# Altium project latch_shutdown_proj.PrjPCB
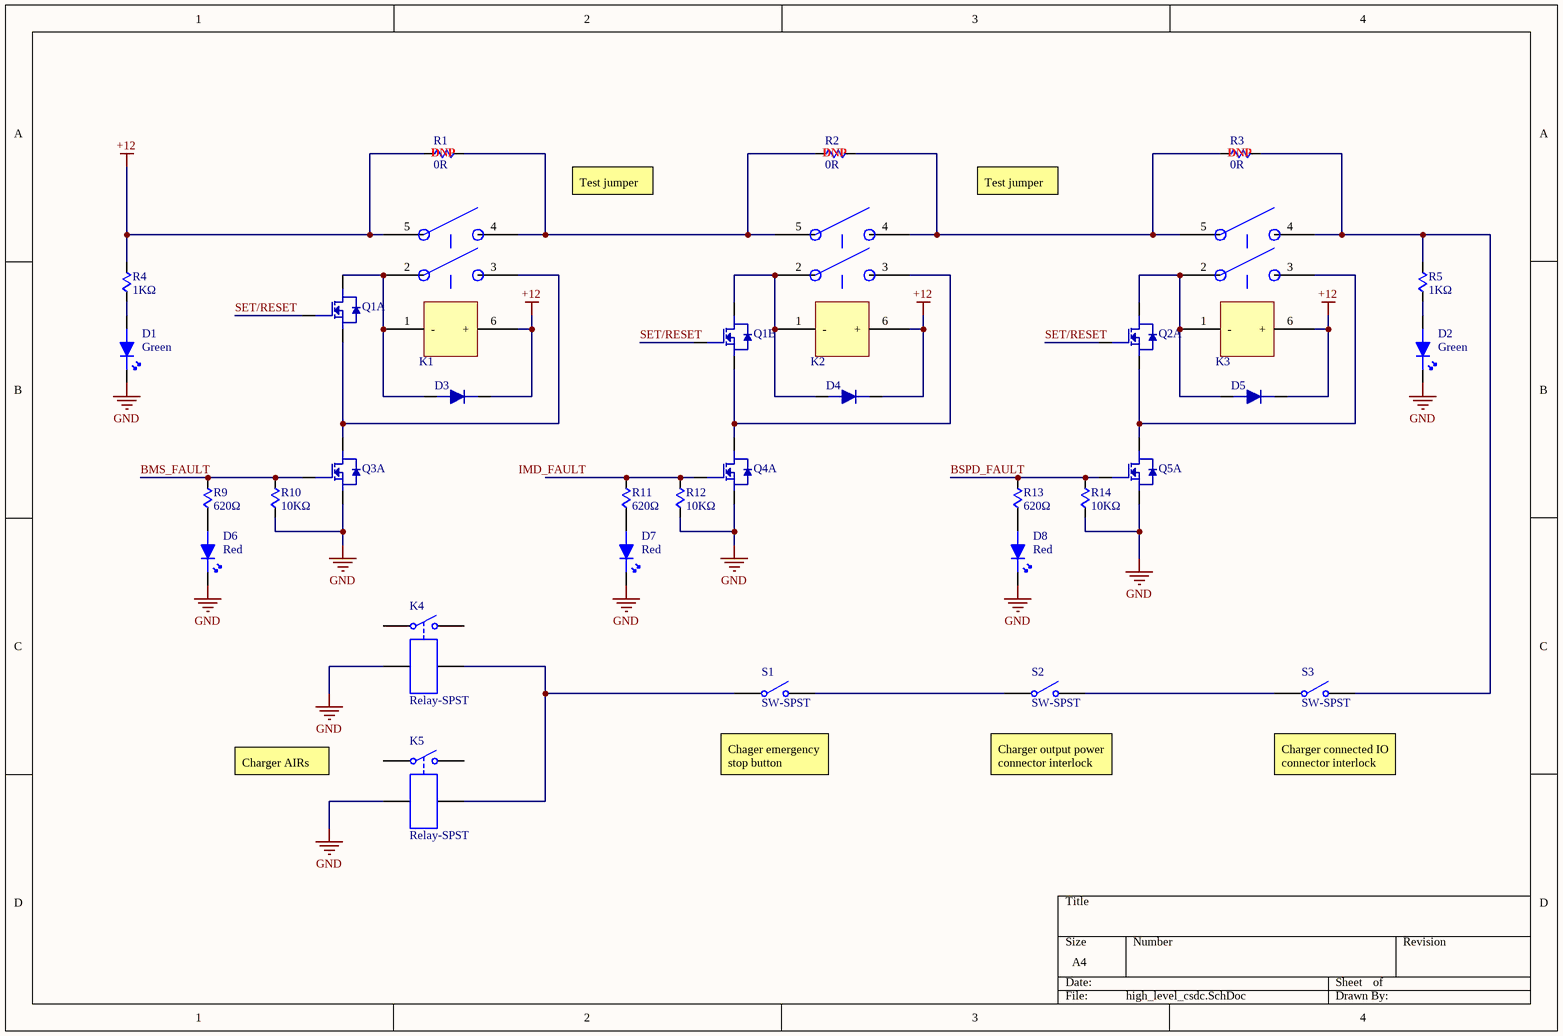
[diagram p0: high_level_csdc.SchDoc]
2 sheets, 67 parts. Net scope: global (net labels, ports and power ports of the same name join across sheets).
Board file: charger_sdc_pcb.PcbDoc
Sheets:
  high_level_csdc.SchDoc
  latch_sdc_sch.SchDoc

## Sheet high_level_csdc.SchDoc
size A4

### Parts
(Parts that share a designator on the sheet are numbered #1, #2 ... from top to bottom, then left to right.)
D1#1  Green  [LED GREEN]
D2#1  Green  [LED GREEN]
D3#1  SD560BTR  [DIOM4436X26N]  (value not drawn)
D4#1  SD560BTR  [DIOM4436X26N]  (value not drawn)
D5#1  SD560BTR  [DIOM4436X26N]  (value not drawn)
D6#1  Red  [LED RED]
D7#1  Red  [LED RED]
D8#1  Red  [LED RED]
K1#1  3A  [RELAY02_FOOTPRINT]  (value not drawn)
K2#1  3A  [RELAY02_FOOTPRINT]  (value not drawn)
K3#1  3A  [RELAY02_FOOTPRINT]  (value not drawn)
K4  Relay-SPST  [MODULE4]
K5  Relay-SPST  [MODULE4]
Q1#1  DMN2029USD-13  [SOIC127P600X175-8N]  (value not drawn)  (parts A,B of 2)
Q2#1  DMN2029USD-13  [SOIC127P600X175-8N]  (value not drawn)  (part A of 2)
Q3#1  DMN2029USD-13  [SOIC127P600X175-8N]  (value not drawn)  (part A of 2)
Q4#1  DMN2029USD-13  [SOIC127P600X175-8N]  (value not drawn)  (part A of 2)
Q5#1  DMN2029USD-13  [SOIC127P600X175-8N]  (value not drawn)  (part A of 2)
R1#1  0R  [0OHM]
R2#1  0R  [0OHM]
R3#1  0R  [0OHM]
R4#1  1KΩ  [1KOHM]
R5#1  1KΩ  [1KOHM]
R9#1  620Ω  [620OHM]
R10#1  10KΩ  [10KOHM]
R11#1  620Ω  [620OHM]
R12#1  10KΩ  [10KOHM]
R13#1  620Ω  [620OHM]
R14#1  10KΩ  [10KOHM]
S1  SW-SPST  [SPST-2]
S2  SW-SPST  [SPST-2]
S3  SW-SPST  [SPST-2]

### Nets
+12: D3#1.2 D4#1.2 D5#1.2 K1#1.5 K1#1.6(+) K2#1.6(+) K3#1.6(+) R1#1.1 R4#1.2
GND: D1#1.2 D2#1.2 D6#1.2 D7#1.2 D8#1.2 K4.3 K5.3 Q3#1.1(S1) Q4#1.1(S1) Q5#1.1(S1) R10#1.1 R12#1.1 R14#1.1
BMS_FAULT: Q3#1.2(G1) R9#1.2 R10#1.2
BSPD_FAULT: Q5#1.2(G1) R13#1.2 R14#1.2
SET/RESET: Q1#1.2(G1) Q1#1.4(G2) Q2#1.2(G1)
NetD1#1_1: D1#1.1 R4#1.1
NetD2#1_1: D2#1.1 R5#1.1
NetD3#1_1: D3#1.1 K1#1.1(-) K1#1.2 Q1#1.8(D1)
NetD4#1_1: D4#1.1 K2#1.1(-) K2#1.2 Q1#1.5(D2)
NetD5#1_1: D5#1.1 K3#1.1(-) K3#1.2 Q2#1.8(D1)
NetD6#1_1: D6#1.1 R9#1.1
NetD7#1_1: D7#1.1 R11#1.1
NetD8#1_1: D8#1.1 R13#1.1
NetK1#1_3: K1#1.3 Q1#1.1(S1) Q3#1.8(D1)
NetK1#1_4: K1#1.4 K2#1.5 R1#1.2 R2#1.1
NetK2#1_3: K2#1.3 Q1#1.3(S2) Q4#1.8(D1)
NetK2#1_4: K2#1.4 K3#1.5 R2#1.2 R3#1.1
NetK3#1_3: K3#1.3 Q2#1.1(S1) Q5#1.8(D1)
NetK3#1_4: K3#1.4 R3#1.2 R5#1.2 S3.2(NO)
NetK4_4: K4.4 K5.4 S1.1(COMMON)
NetQ4#1_2: Q4#1.2(G1) R11#1.2 R12#1.2
NetS1_2: S1.2(NO) S2.1(COMMON)
NetS2_2: S2.2(NO) S3.1(COMMON)

Not connected (* = marked no-connect by the designer): K4 1 2; K5 1 2

### Notes on the sheet
- (near R1#1) DNP
- (near R2#1) DNP
- (near R3#1) DNP
- Test jumper
- Charger AIRs
- (near S1) Chager emergency stop button
- (near S2) Charger output power connector interlock
- (near S3) Charger connected IO connector interlock
- Labels drawn without touching a wire or pin: IMD_FAULT

### Library data of the parts
D1#1 D2#1 = 150060VS75000: WURTH ELEKTRONIK - 150060VS75000 - LED, 0603, B GREEN,  40MCD, 570NM; Manufacturer 1: Wurth Electronics; Viewing Angle: 140°; Forward Voltage: 2V; Lens Style: Clear,Rectangular; Forward Current: 30mA; Test Current: 20mA; Supplier 1: Digi-Key; Manufacturer Part Number 1: 150060VS75000; Stock 1: 111445; Pricing 1: 1=0.14, 50=0.129, 100=0.11, 500=0.095 (USD); Mount: Surface Mount; Case/Package: 0603; Number of Pins: 2; Color: Green; Case Code (Metric): 1608; Case Code (Imperial): 0603; Min Operating Temperature: -40°C; Max Operating Temperature: 85°C; Package Quantity: 1; Packaging: Tape and Reel; Luminous Intensity: 40mcd; Wavelength: 570nm; Dominant Wavelength: 570nm; Length: 1.6mm; Height: 0.7mm; Width: 0.8mm; REACH SVHC: Unknown; ComponentLink1URL: https://katalog.we-online.de/led/datasheet/150060VS75000.pdf?src-supplier=Digi-Key; ComponentLink1Description: https://katalog.we-online.de/led/datasheet/150060VS75000.pdf?src-supplier=Digi-Key; Supplier Part Number 1: 732-4980-6-ND
D3#1 D4#1 D5#1 = SD560BTR: DIODE GEN PURP 600V 5A SMB; Manufacturer: SMC; Supplier 1: Digi-Key; Manufacturer Part Number: SD560BTR; Stock 1: 109105; Pricing 1: 1=0.5, 10=0.358, 100=0.2106, 500=0.11922, 1000=0.0914 (USD); Mount: Surface Mount; Case/Package: SMB; Packaging: Tape and Reel; Max Reverse Voltage (DC): 600V; Average Rectified Current: 5A; Supplier Part Number 1: 1655-1530-1-ND
D6#1 D7#1 D8#1 = 150060RS75000: WURTH ELEKTRONIK - 150060RS75000 - LED, 0603, RED, 250MCD, 625NM; Manufacturer 1: Wurth Electronics; Viewing Angle: 140°; Lens Style: Clear,Rectangular; Forward Current: 30mA; Forward Voltage: 2V; Test Current: 20mA; Supplier 1: Digi-Key; Manufacturer Part Number 1: 150060RS75000; Stock 1: 121418; Pricing 1: 1=0.14, 50=0.129, 100=0.11, 500=0.095 (USD); Mount: Surface Mount; Case/Package: 0603; Color: Red; Case Code (Metric): 1608; Case Code (Imperial): 0603; Min Operating Temperature: -40°C; Max Operating Temperature: 85°C; Package Quantity: 1; Packaging: Cut Tape; Luminous Intensity: 250mcd; Wavelength: 625nm; Dominant Wavelength: 625nm; Length: 1.6mm; Height: 0.7mm; Width: 0.8mm; REACH SVHC: Unknown; ComponentLink1URL: https://katalog.we-online.de/led/datasheet/150060RS75000.pdf?src-supplier=Digi-Key; ComponentLink1Description: https://katalog.we-online.de/led/datasheet/150060RS75000.pdf?src-supplier=Digi-Key; ComponentLink2URL: http://www.produktinfo.conrad.com/datenblaetter/750000-774999/759428-da-01-en-CHIPLED_0603_W_KL_ROT_150060RS75000.pdf?src-supplier=Conrad; ComponentLink2Description: http://www.produktinfo.conrad.com/datenblaetter/750000-774999/759428-da-01-en-CHIPLED_0603_W_KL_ROT_150060RS75000.pdf?src-supplier=Conrad; Supplier Part Number 1: 732-4978-6-ND
K1#1 K2#1 K3#1 = OSA-SS-212DM3,000: RELAY TE CONNECTIVITY / OEG         OSA-SS-212DM3,000             General Purpose Relay, OSA Series, Power, Non Latching, DPST-NO, 12 VDC, 3 A; Coil Current: 45mA; Throw Configuration: DPST; Operate Time: 20ms; Release Time: 10ms; Coil Power: 600mW; Coil Resistance: 270R; Coil Type: Non-Latching; Coil Voltage (DC): 12V; Contact Voltage Rating (AC): 240V; Supplier 1: Digi-Key; Supplier Part Number 1: OSA-SS-212DM3,000-ND; Manufacturer: TE Connectivity; Manufacturer Part Number: OSA-SS-212DM3,000; Stock 1: 2623; Pricing 1: 1=2.54, 10=2.385, 25=2.1204, 50=2.0142, 100=1.9083, 250=1.69624, 500=1.59022, 1000=1.48421, 5000=1.4312 (USD); Mount: Through Hole; Weight: 13g; Contact Material: Silver; Min Operating Temperature: -30°C; Max Operating Temperature: 60°C; Package Quantity: 1000; Packaging: Box; Contact Current Rating: 3A; Termination: PCB; Relay Type: General Purpose; Length: 24.4mm; Height: 0.976inch; Width: 12.9mm; REACH SVHC: Unknown; ELV: Compliant; ComponentLink1URL: http://www.farnell.com/datasheets/1652820.pdf?src-supplier=Farnell; ComponentLink1Description: http://www.farnell.com/datasheets/1652820.pdf?src-supplier=Farnell; ComponentLink2URL: http://www.farnell.com/cad/1652820.pdf?src-supplier=Element14; ComponentLink2Description: http://www.farnell.com/cad/1652820.pdf?src-supplier=Element14; ComponentLink3URL: http://www.te.com/commerce/DocumentDelivery/DDEController?Action=srchrtrv&DocNm=5-1419124-6&DocType=Customer+Drawing&DocLang=English&src-supplier=Digi-Key; ComponentLink3Description: http://www.te.com/commerce/DocumentDelivery/DDEController?Action=srchrtrv&DocNm=5-1419124-6&DocType=Customer+Drawing&DocLang=English&src-supplier=Digi-Key
K4 K5 = Relay-SPST: Single-Pole Single-Throw Relay; Published: 24-Mar-1999; LatestRevisionDate: 17-Jul-2002; LatestRevisionNote: Re-released for DXP Platform.; PackageReference: MODULE4; Publisher: Altium Limited
Q1#1 Q2#1 Q3#1 Q4#1 Q5#1 = DMN2029USD-13: MOSFET 2N-CH 20V 5.8A 8SO; Manufacturer: Diodes; Rds On Max: 25mR; Input Capacitance: 1.171nF; Rise Time: 33.3ns; Max Power Dissipation: 1.2W; Turn-On Delay Time: 16.5ns; Turn-Off Delay Time: 119.3ns; Fall Time: 53.5ns; Drain to Source Resistance: 35mR; Gate to Source Voltage (Vgs): 8V; FET Type: 2 N-Channel; Supplier 1: Digi-Key; Supplier Part Number 1: DMN2029USD-13DICT-ND; Manufacturer Part Number: DMN2029USD-13; Stock 1: 1364; Pricing 1: 1=0.47, 10=0.397, 100=0.2974, 500=0.21812, 1000=0.16854 (USD); Mount: Surface Mount; Case/Package: SO; Number of Pins: 8; Min Operating Temperature: -55°C; Max Operating Temperature: 150°C; Package Quantity: 2500; Packaging: Tape and Reel; Continuous Drain Current (ID): 5.8A; Drain to Source Voltage (Vdss): 20V; Length: 4.95mm; Height: 1.5mm; Width: 3.95mm; Radiation Hardening: No; REACH SVHC: No SVHC; ComponentLink1URL: https://www.diodes.com/assets/Datasheets/DMN2029USD.pdf?src-supplier=Digi-Key; ComponentLink1Description: https://www.diodes.com/assets/Datasheets/DMN2029USD.pdf?src-supplier=Digi-Key
R1#1 R2#1 R3#1 = RMCF0603ZT0R00_1: RES 0 OHM JUMPER 1/10W 0603; Manufacturer: Stackpole Electronics; Resistance: 0mR; Power Rating: 100mW; Current Rating: 1A; Working Voltage: 75V; Supplier 1: Digi-Key; Manufacturer Part Number: RMCF0603ZT0R00; Stock 1: 2474175; Pricing 1: 1=0.1, 10=0.016, 25=0.0116, 50=0.0088, 100=0.0064, 250=0.00492, 500=0.00392, 1000=0.00289 (USD); Mount: Surface Mount; Case/Package: 0603; Case Code (Metric): 1608; Case Code (Imperial): 0603; Contact Plating: Tin,Matte; Min Operating Temperature: -55°C; Max Operating Temperature: 155°C; Packaging: Tape and Reel; Composition: Thick Film; Number of Terminations: 2; Military Standard: Not; Max Power Dissipation: 100mW; Features: Automotive AEC-Q200; Length: 1.55mm; Height: 0.022inch; Width: 0.031inch; Depth: 0.8mm; Radiation Hardening: No; Lead Free: Lead Free; ComponentLink1URL: https://www.seielect.com/catalog/SEI-Packaging.pdf?src-supplier=Avnet; ComponentLink1Description: https://www.seielect.com/catalog/SEI-Packaging.pdf?src-supplier=Avnet; ComponentLink2URL: https://www.seielect.com/catalog/SEI-Packaging.pdf?src-supplier=Verical; ComponentLink2Description: https://www.seielect.com/catalog/SEI-Packaging.pdf?src-supplier=Verical; ComponentLink3URL: https://www.seielect.com/catalog/SEI-Packaging.pdf?src-supplier=Arrow; ComponentLink3Description: https://www.seielect.com/catalog/SEI-Packaging.pdf?src-supplier=Arrow; ComponentLink4URL: https://www.seielect.com/catalog/SEI-Packaging.pdf?src-supplier=Digi-Key; ComponentLink4Description: https://www.seielect.com/catalog/SEI-Packaging.pdf?src-supplier=Digi-Key; ComponentLink5URL: https://www.seielect.com/Catalog/SEI-RMCF_RMCP.pdf?src-supplier=Digi-Key; ComponentLink5Description: https://www.seielect.com/Catalog/SEI-RMCF_RMCP.pdf?src-supplier=Digi-Key; Supplier Part Number 1: RMCF0603ZT0R00DKR-ND
R4#1 R5#1 = RC0201FR-071KL: YAGEO - RC0201FR-071KL - DICKSCHICHTWIDERSTAND 1K 1% 0.05W 0201; Resistance: 1kR; Power Rating: 50mW; Voltage Rating: 25V; Temperature Coefficient: 200ppm/°C; Supplier 1: Digi-Key; Manufacturer 1: Yageo; Manufacturer Part Number 1: RC0201FR-071KL; Stock 1: 3545827; Pricing 1: 1=0.1, 10=0.042, 100=0.0171, 1000=0.00768, 2500=0.00666, 5000=0.00551 (USD); Case/Package: 0201; Case Code (Metric): 0603; Case Code (Imperial): 0201; Contact Plating: Tin,Matte; Min Operating Temperature: -55°C; Max Operating Temperature: 125°C; Package Quantity: 10000; Packaging: Tape and Reel; Tolerance: 1%; Composition: Thick Film; Number of Terminations: 2; Termination: SMD/SMT; Military Standard: Not; Max Power Dissipation: 50mW; Working Voltage: 25V; Features: Moisture Resistant; Length: 0.024inch; Height: 0.01inch; Width: 0.012inch; Depth: 0.3mm; Radiation Hardening: No; REACH SVHC: Unknown; Lead Free: Lead Free; ComponentLink1URL: http://www.yageo.com/documents/recent/PYu-RC0201_51_RoHS_L_8.pdf?src-supplier=Avnet+Europe; ComponentLink1Description: http://www.yageo.com/documents/recent/PYu-RC0201_51_RoHS_L_8.pdf?src-supplier=Avnet+Europe; ComponentLink2URL: http://www.farnell.com/datasheets/2167052.pdf?src-supplier=Element14; ComponentLink2Description: http://www.farnell.com/datasheets/2167052.pdf?src-supplier=Element14; ComponentLink3URL: http://www.yageo.com/documents/recent/PYu-RC_Group_51_RoHS_L_10.pdf?src-supplier=Digi-Key; ComponentLink3Description: http://www.yageo.com/documents/recent/PYu-RC_Group_51_RoHS_L_10.pdf?src-supplier=Digi-Key; ComponentLink4URL: http://www.yageo.com/documents/recent/PYu-RC0201_51_RoHS_L_8.pdf?src-supplier=Avnet; ComponentLink4Description: http://www.yageo.com/documents/recent/PYu-RC0201_51_RoHS_L_8.pdf?src-supplier=Avnet; Supplier Part Number 1: 311-1KMDKR-ND
R9#1 R11#1 R13#1 = RC0201FR-07620RL: RC0201 Series 0201 0.05 W 620 Ohms 1% ±200 ppm/°C SMT Thick Film Chip Resistor; Manufacturer 1: Yageo; Voltage Rating: 25V; Resistance: 620R; Power Rating: 50mW; Supplier 1: Digi-Key; Manufacturer Part Number 1: RC0201FR-07620RL; Stock 1: 50190; Pricing 1: 1=0.1, 10=0.042, 100=0.0171, 1000=0.00768, 2500=0.00666, 5000=0.00551 (USD); Case/Package: 0201; Case Code (Metric): 0603; Case Code (Imperial): 0201; Min Operating Temperature: -55°C; Max Operating Temperature: 125°C; Tolerance: 1%; Packaging: Tape and Reel; Package Quantity: 10000; Composition: Thick Film; Number of Terminations: 2; Termination: SMD/SMT; Military Standard: Not; Max Power Dissipation: 50mW; Temperature Coefficient: 200ppm/°C; Features: Moisture Resistant; Length: 0.6mm; Height: 0.01inch; Width: 0.012inch; Depth: 0.3mm; Lead Free: Lead Free; ComponentLink1URL: http://www.yageo.com.tw/exep/pages/download/literatures/PYu-R_INT-thick_7.pdf?src-supplier=Digi-Key; ComponentLink1Description: http://www.yageo.com.tw/exep/pages/download/literatures/PYu-R_INT-thick_7.pdf?src-supplier=Digi-Key; Supplier Part Number 1: YAG2348CT-ND
R10#1 R12#1 R14#1 = RNCP0603FTD10K0: RES 10K OHM 1% 1/8W 0603; Manufacturer: Stackpole Electronics; Resistance: 10kR; Max Power Dissipation: 125mW; Temperature Coefficient: 100ppm/°C; Supplier 1: Digi-Key; Manufacturer Part Number: RNCP0603FTD10K0; Stock 1: 85524; Pricing 1: 1=0.1, 10=0.067, 100=0.0273, 1000=0.01224, 2500=0.01063 (USD); Mount: Surface Mount; Case/Package: 0603; Case Code (Metric): 1608; Case Code (Imperial): 0603; Contact Plating: Tin,Matte; Min Operating Temperature: -55°C; Max Operating Temperature: 155°C; Packaging: Tape and Reel; Tolerance: 1%; Composition: Thin Film; Number of Terminations: 2; Features: Moisture Resistant,Anti-Sulfur; Length: 0.059inch; Height: 0.02inch; Width: 0.031inch; Radiation Hardening: No; Lead Free: Lead Free; Supplier Part Number 1: RNCP0603FTD10K0DKR-ND
S1-S3 = SW-SPST: Single-Pole, Single-Throw Switch; Published: 24-Mar-1999; LatestRevisionDate: 17-Jul-2002; LatestRevisionNote: Re-released for DXP Platform.; PackageReference: SPST-2; Publisher: Altium Limited; PackageDescription: Switch; 2 Leads

## Sheet latch_sdc_sch.SchDoc: Shutdown Circuit
size Letter; DrawnBy: Steven Richter; Engineer: Steven Richter
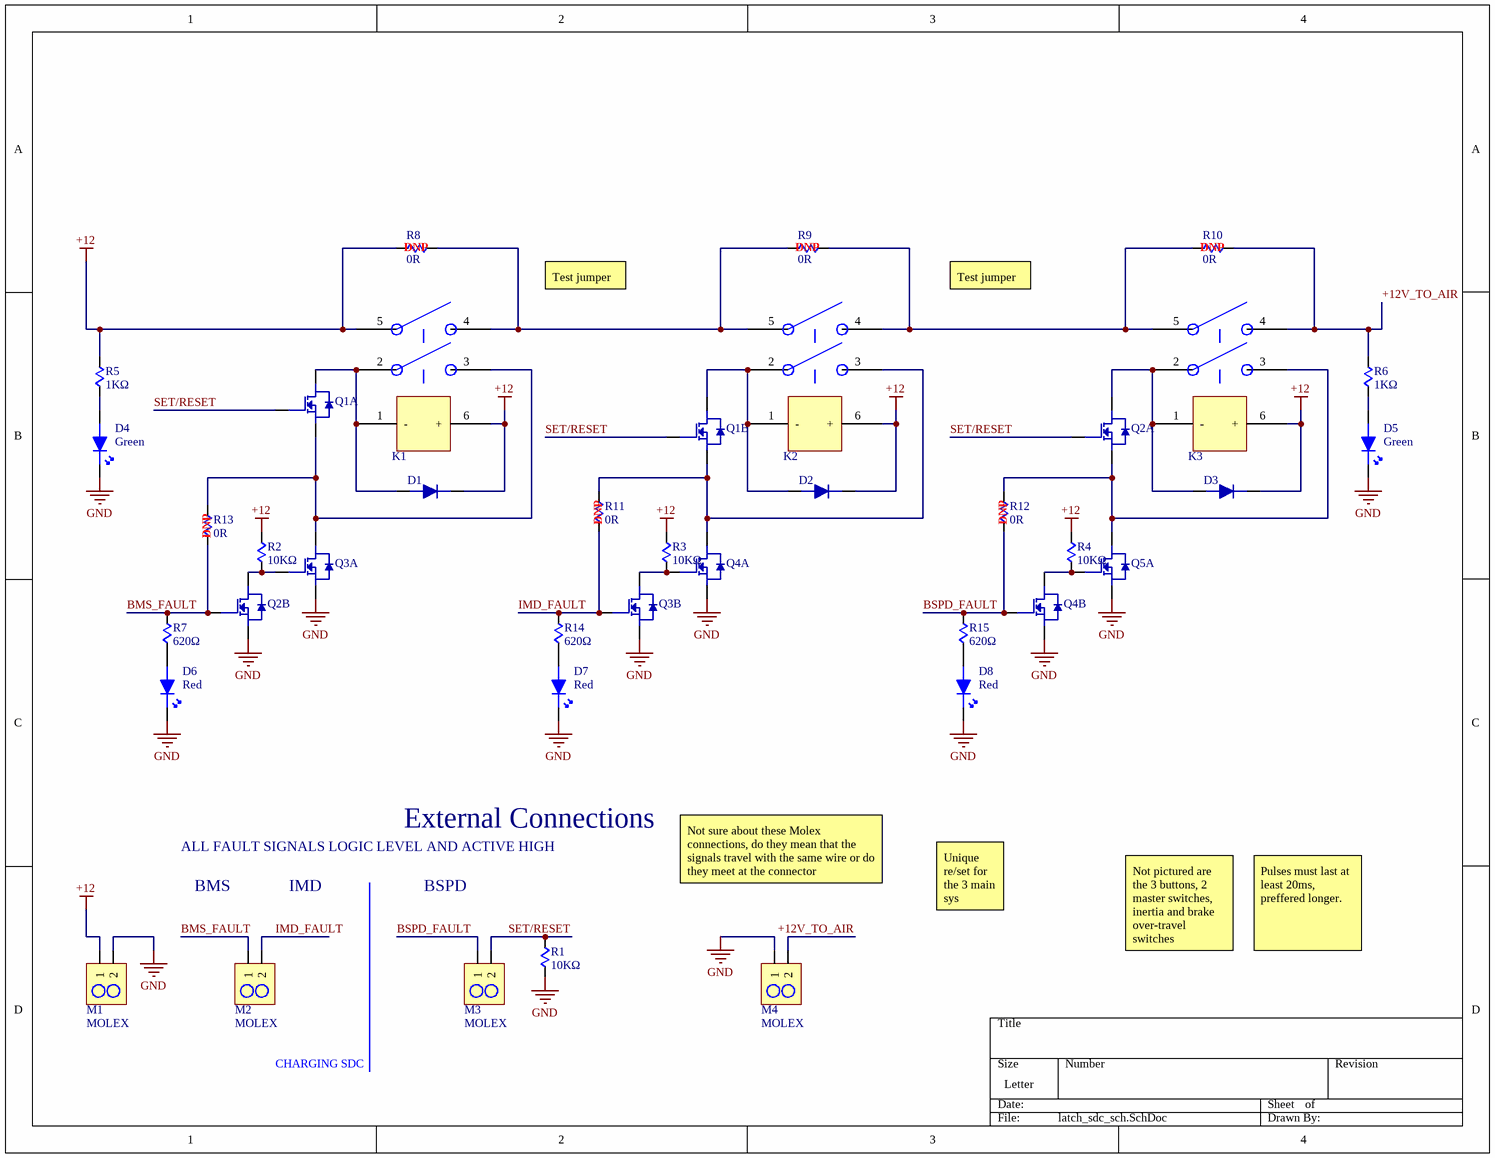
[diagram p1: latch_sdc_sch.SchDoc]

### Parts
(Parts that share a designator on the sheet are numbered #1, #2 ... from top to bottom, then left to right.)
D1#2  SD560BTR  [DIOM4436X26N]  (value not drawn)
D2#2  SD560BTR  [DIOM4436X26N]  (value not drawn)
D3#2  SD560BTR  [DIOM4436X26N]  (value not drawn)
D4#2  Green  [LED GREEN]
D5#2  Green  [LED GREEN]
D6#2  Red  [LED RED]
D7#2  Red  [LED RED]
D8#2  Red  [LED RED]
K1#2  3A  [RELAY02_FOOTPRINT]  (value not drawn)
K2#2  3A  [RELAY02_FOOTPRINT]  (value not drawn)
K3#2  3A  [RELAY02_FOOTPRINT]  (value not drawn)
M1  MOLEX  [MOLEX 1]
M2  MOLEX  [MOLEX 1]
M3  MOLEX  [MOLEX 1]
M4  MOLEX  [MOLEX 1]
Q1#2  DMN2029USD-13  [SOIC127P600X175-8N]  (value not drawn)  (parts A,B of 2)
Q2#1  DMN2029USD-13  [SOIC127P600X175-8N]  (value not drawn)  (part B of 2)
Q2#2  DMN2029USD-13  [SOIC127P600X175-8N]  (value not drawn)  (part A of 2)
Q3#1  DMN2029USD-13  [SOIC127P600X175-8N]  (value not drawn)  (part B of 2)
Q3#2  DMN2029USD-13  [SOIC127P600X175-8N]  (value not drawn)  (part A of 2)
Q4#1  DMN2029USD-13  [SOIC127P600X175-8N]  (value not drawn)  (part B of 2)
Q4#2  DMN2029USD-13  [SOIC127P600X175-8N]  (value not drawn)  (part A of 2)
Q5#2  DMN2029USD-13  [SOIC127P600X175-8N]  (value not drawn)  (part A of 2)
R1#2  10KΩ  [10KOHM]
R2#2  10KΩ  [10KOHM]
R3#2  10KΩ  [10KOHM]
R4#2  10KΩ  [10KOHM]
R5#2  1KΩ  [1KOHM]
R6  1KΩ  [1KOHM]
R7  620Ω  [620OHM]
R8  0R  [0OHM]
R9#2  0R  [0OHM]
R10#2  0R  [0OHM]
R11#2  0R  [0OHM]
R12#2  0R  [0OHM]
R13#2  0R  [0OHM]
R14#2  620Ω  [620OHM]
R15  620Ω  [620OHM]

### Nets
+12: D1#2.2 D2#2.2 D3#2.2 K1#2.5 K1#2.6(+) K2#2.6(+) K3#2.6(+) M1.1 R2#2.1 R3#2.1 R4#2.1 R5#2.2 R8.1
GND: D4#2.2 D5#2.2 D6#2.2 D7#2.2 D8#2.2 M1.2 M4.1 Q2#1.3(S2) Q3#1.3(S2) Q3#2.1(S1) Q4#1.3(S2) Q4#2.1(S1) Q5#2.1(S1) R1#2.2
+12V_TO_AIR: K3#2.4 M4.2 R6.2 R10#2.2
BMS_FAULT: M2.1 Q2#1.4(G2) R7.2 R13#2.1
BSPD_FAULT: M3.1 Q4#1.4(G2) R12#2.1 R15.2
IMD_FAULT: M2.2 Q3#1.4(G2) R11#2.1 R14#2.2
SET/RESET: M3.2 Q1#2.2(G1) Q1#2.4(G2) Q2#2.2(G1) R1#2.1
NetD1#2_1: D1#2.1 K1#2.1(-) K1#2.2 Q1#2.8(D1)
NetD2#2_1: D2#2.1 K2#2.1(-) K2#2.2 Q1#2.5(D2)
NetD3#2_1: D3#2.1 K3#2.1(-) K3#2.2 Q2#2.8(D1)
NetD4#2_1: D4#2.1 R5#2.1
NetD5#2_1: D5#2.1 R6.1
NetD6#2_1: D6#2.1 R7.1
NetD7#2_1: D7#2.1 R14#2.1
NetD8#2_1: D8#2.1 R15.1
NetK1#2_3: K1#2.3 Q1#2.1(S1) Q3#2.8(D1) R13#2.2
NetK1#2_4: K1#2.4 K2#2.5 R8.2 R9#2.1
NetK2#2_3: K2#2.3 Q1#2.3(S2) Q4#2.8(D1) R11#2.2
NetK2#2_4: K2#2.4 K3#2.5 R9#2.2 R10#2.1
NetK3#2_3: K3#2.3 Q2#2.1(S1) Q5#2.8(D1) R12#2.2
NetQ2#1_5: Q2#1.5(D2) Q3#2.2(G1) R2#2.2
NetQ3#1_5: Q3#1.5(D2) Q4#2.2(G1) R3#2.2
NetQ4#1_5: Q4#1.5(D2) Q5#2.2(G1) R4#2.2

### Notes on the sheet
- (near R8) DNP
- Test jumper
- (near R9#2) DNP
- (near R10#2) DNP
- (near R13#2) DNP
- (near R11#2) DNP
- (near R12#2) DNP
- External Connections
- ALL FAULT SIGNALS LOGIC LEVEL AND ACTIVE HIGH
- BMS
- IMD
- BSPD
- Not sure about these Molex connections, do they mean that the signals travel with the same wire or do they meet at the connector
- Unique re/set for the 3 main sys
- Not pictured are the 3 buttons, 2 master switches, inertia and brake over-travel switches
- Pulses must last at least 20ms, preffered longer.
- CHARGING SDC

### Library data of the parts
D1#2 D2#2 D3#2 = SD560BTR: as D3#1 on sheet high_level_csdc; Supplier 1: Digi-Key; Manufacturer Part Number: SD560BTR; Stock 1: 109105; Pricing 1: 1=0.5, 10=0.358, 100=0.2106, 500=0.11922, 1000=0.0914 (USD); Mount: Surface Mount; Case/Package: SMB; Packaging: Tape and Reel; Max Reverse Voltage (DC): 600V; Average Rectified Current: 5A; Supplier Part Number 1: 1655-1530-1-ND
D4#2 D5#2 = 150060VS75000: as D1#1 on sheet high_level_csdc; Supplier 1: Digi-Key; Manufacturer Part Number 1: 150060VS75000; Stock 1: 111445; Pricing 1: 1=0.14, 50=0.129, 100=0.11, 500=0.095 (USD); Mount: Surface Mount; Case/Package: 0603; Number of Pins: 2; Color: Green; Case Code (Metric): 1608; Case Code (Imperial): 0603; Min Operating Temperature: -40°C; Max Operating Temperature: 85°C; Package Quantity: 1; Packaging: Tape and Reel; Luminous Intensity: 40mcd; Wavelength: 570nm; Dominant Wavelength: 570nm; Length: 1.6mm; Height: 0.7mm; Width: 0.8mm; REACH SVHC: Unknown; ComponentLink1URL: https://katalog.we-online.de/led/datasheet/150060VS75000.pdf?src-supplier=Digi-Key; ComponentLink1Description: https://katalog.we-online.de/led/datasheet/150060VS75000.pdf?src-supplier=Digi-Key; Supplier Part Number 1: 732-4980-6-ND
D6#2 D7#2 D8#2 = 150060RS75000: as D6#1 on sheet high_level_csdc; Supplier 1: Digi-Key; Manufacturer Part Number 1: 150060RS75000; Stock 1: 121418; Pricing 1: 1=0.14, 50=0.129, 100=0.11, 500=0.095 (USD); Mount: Surface Mount; Case/Package: 0603; Color: Red; Case Code (Metric): 1608; Case Code (Imperial): 0603; Min Operating Temperature: -40°C; Max Operating Temperature: 85°C; Package Quantity: 1; Packaging: Cut Tape; Luminous Intensity: 250mcd; Wavelength: 625nm; Dominant Wavelength: 625nm; Length: 1.6mm; Height: 0.7mm; Width: 0.8mm; REACH SVHC: Unknown; ComponentLink1URL: https://katalog.we-online.de/led/datasheet/150060RS75000.pdf?src-supplier=Digi-Key; ComponentLink1Description: https://katalog.we-online.de/led/datasheet/150060RS75000.pdf?src-supplier=Digi-Key; ComponentLink2URL: http://www.produktinfo.conrad.com/datenblaetter/750000-774999/759428-da-01-en-CHIPLED_0603_W_KL_ROT_150060RS75000.pdf?src-supplier=Conrad; ComponentLink2Description: http://www.produktinfo.conrad.com/datenblaetter/750000-774999/759428-da-01-en-CHIPLED_0603_W_KL_ROT_150060RS75000.pdf?src-supplier=Conrad; Supplier Part Number 1: 732-4978-6-ND
K1#2 K2#2 K3#2 = OSA-SS-212DM3,000: as K1#1 on sheet high_level_csdc; Supplier 1: Digi-Key; Supplier Part Number 1: OSA-SS-212DM3,000-ND; Manufacturer: TE Connectivity; Manufacturer Part Number: OSA-SS-212DM3,000; Stock 1: 2623; Pricing 1: 1=2.54, 10=2.385, 25=2.1204, 50=2.0142, 100=1.9083, 250=1.69624, 500=1.59022, 1000=1.48421, 5000=1.4312 (USD); Mount: Through Hole; Weight: 13g; Contact Material: Silver; Min Operating Temperature: -30°C; Max Operating Temperature: 60°C; Package Quantity: 1000; Packaging: Box; Contact Current Rating: 3A; Termination: PCB; Relay Type: General Purpose; Length: 24.4mm; Height: 0.976inch; Width: 12.9mm; REACH SVHC: Unknown; ELV: Compliant; ComponentLink1URL: http://www.farnell.com/datasheets/1652820.pdf?src-supplier=Farnell; ComponentLink1Description: http://www.farnell.com/datasheets/1652820.pdf?src-supplier=Farnell; ComponentLink2URL: http://www.farnell.com/cad/1652820.pdf?src-supplier=Element14; ComponentLink2Description: http://www.farnell.com/cad/1652820.pdf?src-supplier=Element14; ComponentLink3URL: http://www.te.com/commerce/DocumentDelivery/DDEController?Action=srchrtrv&DocNm=5-1419124-6&DocType=Customer+Drawing&DocLang=English&src-supplier=Digi-Key; ComponentLink3Description: http://www.te.com/commerce/DocumentDelivery/DDEController?Action=srchrtrv&DocNm=5-1419124-6&DocType=Customer+Drawing&DocLang=English&src-supplier=Digi-Key
M1-M4 = 43650-0200: MOLEX - 43650-0200 - CONNECTOR, HEADER, 2POS, 1ROW, 3MM; Contact Resistance: 10mR; Number of Positions: 2; Connector Type: Plug,Socket; Current Rating: 5A; Voltage Rating (AC): 250V; Voltage Rating: 600V; Gender: Male; Insulation Resistance: 1GR; Glow Wire Compliant: Compliant; Supplier 1: Avnet; Manufacturer: Molex; Manufacturer Part Number: 43650-0200; Stock 1: 0; Pricing 1: 1=0.39494, 10=0.36394, 25=0.34123, 50=0.33065, 100=0.32119 (USD); Mount: Through Hole; Contact Plating: Tin; Contact Material: Brass,Tin; Color: Black; Housing Color: Black; Housing Material: Thermoplastic; Min Operating Temperature: -40°C; Max Operating Temperature: 105°C; Number of Rows: 1; Packaging: Tray; Termination: Solder; Number of Contacts: 2; Orientation: Right Angle; Package Quantity: 3927; Working Voltage: 250V; Number of Circuits: 2; Voltage Rating (DC): 250V; Length: 9.65mm; Height: 5.57mm; Pitch: 3mm; Depth: 9.9mm; Radiation Hardening: No; Flammability Rating: UL94 V-0; REACH SVHC: Unknown; Halogen Free: Low Halogen; Lead Free: Lead Free; ComponentLink1URL: http://www.molex.com/webdocs/datasheets/pdf/en-us/0436500200_PCB_HEADERS.pdf?src-supplier=Avnet; ComponentLink1Description: http://www.molex.com/webdocs/datasheets/pdf/en-us/0436500200_PCB_HEADERS.pdf?src-supplier=Avnet; ComponentLink2URL: http://www.onlinecomponents.com/productFiles/mf-MOL/1029720436500200_pcb_headers.pdf?src-supplier=Onlinecomponents.com; ComponentLink2Description: http://www.onlinecomponents.com/productFiles/mf-MOL/1029720436500200_pcb_headers.pdf?src-supplier=Onlinecomponents.com; ComponentLink3URL: http://www.farnell.com/datasheets/1933359.pdf?src-supplier=Element14; ComponentLink3Description: http://www.farnell.com/datasheets/1933359.pdf?src-supplier=Element14; ComponentLink4URL: https://www.distrelec.biz/Web/Downloads/20/66/04402066.pdf?mime=application%2Fpdf&src-supplier=Distrelec; ComponentLink4Description: https://www.distrelec.biz/Web/Downloads/20/66/04402066.pdf?mime=application%2Fpdf&src-supplier=Distrelec; ComponentLink5URL: http://www.jameco.com/Jameco/Products/ProdDS/884053.pdf?src-supplier=Jameco; ComponentLink5Description: http://www.jameco.com/Jameco/Products/ProdDS/884053.pdf?src-supplier=Jameco; ComponentLink6URL: http://www.mouser.com/ds/2/276/0436500200_PCB_HEADERS-148844.pdf?src-supplier=Mouser; ComponentLink6Description: http://www.mouser.com/ds/2/276/0436500200_PCB_HEADERS-148844.pdf?src-supplier=Mouser; ComponentLink7URL: http://uk.rs-online.com/webdocs/13c3/0900766b813c3b7d.pdf?src-supplier=RSComponents; ComponentLink7Description: http://uk.rs-online.com/webdocs/13c3/0900766b813c3b7d.pdf?src-supplier=RSComponents; ComponentLink8URL: http://www.molex.com/webdocs/datasheets/pdf/en-us/0436500200_PCB_HEADERS.pdf?src-supplier=Avnet+Europe; ComponentLink8Description: http://www.molex.com/webdocs/datasheets/pdf/en-us/0436500200_PCB_HEADERS.pdf?src-supplier=Avnet+Europe; ComponentLink9URL: http://www.farnell.com/datasheets/1709823.pdf?src-supplier=Element14; ComponentLink9Description: http://www.farnell.com/datasheets/1709823.pdf?src-supplier=Element14; Supplier Part Number 1: 0436500200
Q1#2 Q2#1 Q2#2 Q3#1 Q3#2 Q4#1 Q4#2 Q5#2 = DMN2029USD-13: as Q1#1 on sheet high_level_csdc; Supplier 1: Digi-Key; Supplier Part Number 1: DMN2029USD-13DICT-ND; Manufacturer Part Number: DMN2029USD-13; Stock 1: 1364; Pricing 1: 1=0.47, 10=0.397, 100=0.2974, 500=0.21812, 1000=0.16854 (USD); Mount: Surface Mount; Case/Package: SO; Number of Pins: 8; Min Operating Temperature: -55°C; Max Operating Temperature: 150°C; Package Quantity: 2500; Packaging: Tape and Reel; Continuous Drain Current (ID): 5.8A; Drain to Source Voltage (Vdss): 20V; Length: 4.95mm; Height: 1.5mm; Width: 3.95mm; Radiation Hardening: No; REACH SVHC: No SVHC; ComponentLink1URL: https://www.diodes.com/assets/Datasheets/DMN2029USD.pdf?src-supplier=Digi-Key; ComponentLink1Description: https://www.diodes.com/assets/Datasheets/DMN2029USD.pdf?src-supplier=Digi-Key
R1#2 R2#2 R3#2 R4#2 = RNCP0603FTD10K0: as R10#1 on sheet high_level_csdc; Supplier 1: Digi-Key; Manufacturer Part Number: RNCP0603FTD10K0; Stock 1: 85524; Pricing 1: 1=0.1, 10=0.067, 100=0.0273, 1000=0.01224, 2500=0.01063 (USD); Mount: Surface Mount; Case/Package: 0603; Case Code (Metric): 1608; Case Code (Imperial): 0603; Contact Plating: Tin,Matte; Min Operating Temperature: -55°C; Max Operating Temperature: 155°C; Packaging: Tape and Reel; Tolerance: 1%; Composition: Thin Film; Number of Terminations: 2; Features: Moisture Resistant,Anti-Sulfur; Length: 0.059inch; Height: 0.02inch; Width: 0.031inch; Radiation Hardening: No; Lead Free: Lead Free; Supplier Part Number 1: RNCP0603FTD10K0DKR-ND
R5#2 R6 = RC0201FR-071KL: as R4#1 on sheet high_level_csdc; Supplier 1: Digi-Key; Manufacturer 1: Yageo; Manufacturer Part Number 1: RC0201FR-071KL; Stock 1: 3545827; Pricing 1: 1=0.1, 10=0.042, 100=0.0171, 1000=0.00768, 2500=0.00666, 5000=0.00551 (USD); Case/Package: 0201; Case Code (Metric): 0603; Case Code (Imperial): 0201; Contact Plating: Tin,Matte; Min Operating Temperature: -55°C; Max Operating Temperature: 125°C; Package Quantity: 10000; Packaging: Tape and Reel; Tolerance: 1%; Composition: Thick Film; Number of Terminations: 2; Termination: SMD/SMT; Military Standard: Not; Max Power Dissipation: 50mW; Working Voltage: 25V; Features: Moisture Resistant; Length: 0.024inch; Height: 0.01inch; Width: 0.012inch; Depth: 0.3mm; Radiation Hardening: No; REACH SVHC: Unknown; Lead Free: Lead Free; ComponentLink1URL: http://www.yageo.com/documents/recent/PYu-RC0201_51_RoHS_L_8.pdf?src-supplier=Avnet+Europe; ComponentLink1Description: http://www.yageo.com/documents/recent/PYu-RC0201_51_RoHS_L_8.pdf?src-supplier=Avnet+Europe; ComponentLink2URL: http://www.farnell.com/datasheets/2167052.pdf?src-supplier=Element14; ComponentLink2Description: http://www.farnell.com/datasheets/2167052.pdf?src-supplier=Element14; ComponentLink3URL: http://www.yageo.com/documents/recent/PYu-RC_Group_51_RoHS_L_10.pdf?src-supplier=Digi-Key; ComponentLink3Description: http://www.yageo.com/documents/recent/PYu-RC_Group_51_RoHS_L_10.pdf?src-supplier=Digi-Key; ComponentLink4URL: http://www.yageo.com/documents/recent/PYu-RC0201_51_RoHS_L_8.pdf?src-supplier=Avnet; ComponentLink4Description: http://www.yageo.com/documents/recent/PYu-RC0201_51_RoHS_L_8.pdf?src-supplier=Avnet; Supplier Part Number 1: 311-1KMDKR-ND
R7 R14#2 R15 = RC0201FR-07620RL: as R9#1 on sheet high_level_csdc; Supplier 1: Digi-Key; Manufacturer Part Number 1: RC0201FR-07620RL; Stock 1: 50190; Pricing 1: 1=0.1, 10=0.042, 100=0.0171, 1000=0.00768, 2500=0.00666, 5000=0.00551 (USD); Case/Package: 0201; Case Code (Metric): 0603; Case Code (Imperial): 0201; Min Operating Temperature: -55°C; Max Operating Temperature: 125°C; Tolerance: 1%; Packaging: Tape and Reel; Package Quantity: 10000; Composition: Thick Film; Number of Terminations: 2; Termination: SMD/SMT; Military Standard: Not; Max Power Dissipation: 50mW; Temperature Coefficient: 200ppm/°C; Features: Moisture Resistant; Length: 0.6mm; Height: 0.01inch; Width: 0.012inch; Depth: 0.3mm; Lead Free: Lead Free; ComponentLink1URL: http://www.yageo.com.tw/exep/pages/download/literatures/PYu-R_INT-thick_7.pdf?src-supplier=Digi-Key; ComponentLink1Description: http://www.yageo.com.tw/exep/pages/download/literatures/PYu-R_INT-thick_7.pdf?src-supplier=Digi-Key; Supplier Part Number 1: YAG2348CT-ND
R8 R9#2 R10#2 R11#2 R12#2 R13#2 = RMCF0603ZT0R00_1: as R1#1 on sheet high_level_csdc; Supplier 1: Digi-Key; Manufacturer Part Number: RMCF0603ZT0R00; Stock 1: 2474175; Pricing 1: 1=0.1, 10=0.016, 25=0.0116, 50=0.0088, 100=0.0064, 250=0.00492, 500=0.00392, 1000=0.00289 (USD); Mount: Surface Mount; Case/Package: 0603; Case Code (Metric): 1608; Case Code (Imperial): 0603; Contact Plating: Tin,Matte; Min Operating Temperature: -55°C; Max Operating Temperature: 155°C; Packaging: Tape and Reel; Composition: Thick Film; Number of Terminations: 2; Military Standard: Not; Max Power Dissipation: 100mW; Features: Automotive AEC-Q200; Length: 1.55mm; Height: 0.022inch; Width: 0.031inch; Depth: 0.8mm; Radiation Hardening: No; Lead Free: Lead Free; ComponentLink1URL: https://www.seielect.com/catalog/SEI-Packaging.pdf?src-supplier=Avnet; ComponentLink1Description: https://www.seielect.com/catalog/SEI-Packaging.pdf?src-supplier=Avnet; ComponentLink2URL: https://www.seielect.com/catalog/SEI-Packaging.pdf?src-supplier=Verical; ComponentLink2Description: https://www.seielect.com/catalog/SEI-Packaging.pdf?src-supplier=Verical; ComponentLink3URL: https://www.seielect.com/catalog/SEI-Packaging.pdf?src-supplier=Arrow; ComponentLink3Description: https://www.seielect.com/catalog/SEI-Packaging.pdf?src-supplier=Arrow; ComponentLink4URL: https://www.seielect.com/catalog/SEI-Packaging.pdf?src-supplier=Digi-Key; ComponentLink4Description: https://www.seielect.com/catalog/SEI-Packaging.pdf?src-supplier=Digi-Key; ComponentLink5URL: https://www.seielect.com/Catalog/SEI-RMCF_RMCP.pdf?src-supplier=Digi-Key; ComponentLink5Description: https://www.seielect.com/Catalog/SEI-RMCF_RMCP.pdf?src-supplier=Digi-Key; Supplier Part Number 1: RMCF0603ZT0R00DKR-ND

## Nets that join several sheets
+12: high_level_csdc (9 pins), latch_sdc_sch (13 pins)
GND: high_level_csdc (13 pins), latch_sdc_sch (14 pins)
BMS_FAULT: high_level_csdc (Q3#1.2 R9#1.2 R10#1.2), latch_sdc_sch (M2.1 Q2#1.4 R7.2 R13#2.1)
BSPD_FAULT: high_level_csdc (Q5#1.2 R13#1.2 R14#1.2), latch_sdc_sch (M3.1 Q4#1.4 R12#2.1 R15.2)
SET/RESET: high_level_csdc (Q1#1.2 Q1#1.4 Q2#1.2), latch_sdc_sch (5 pins)